# Altium schematic sheet Page10 BOOT_CFG.SchDoc
size 594 x 420 mm
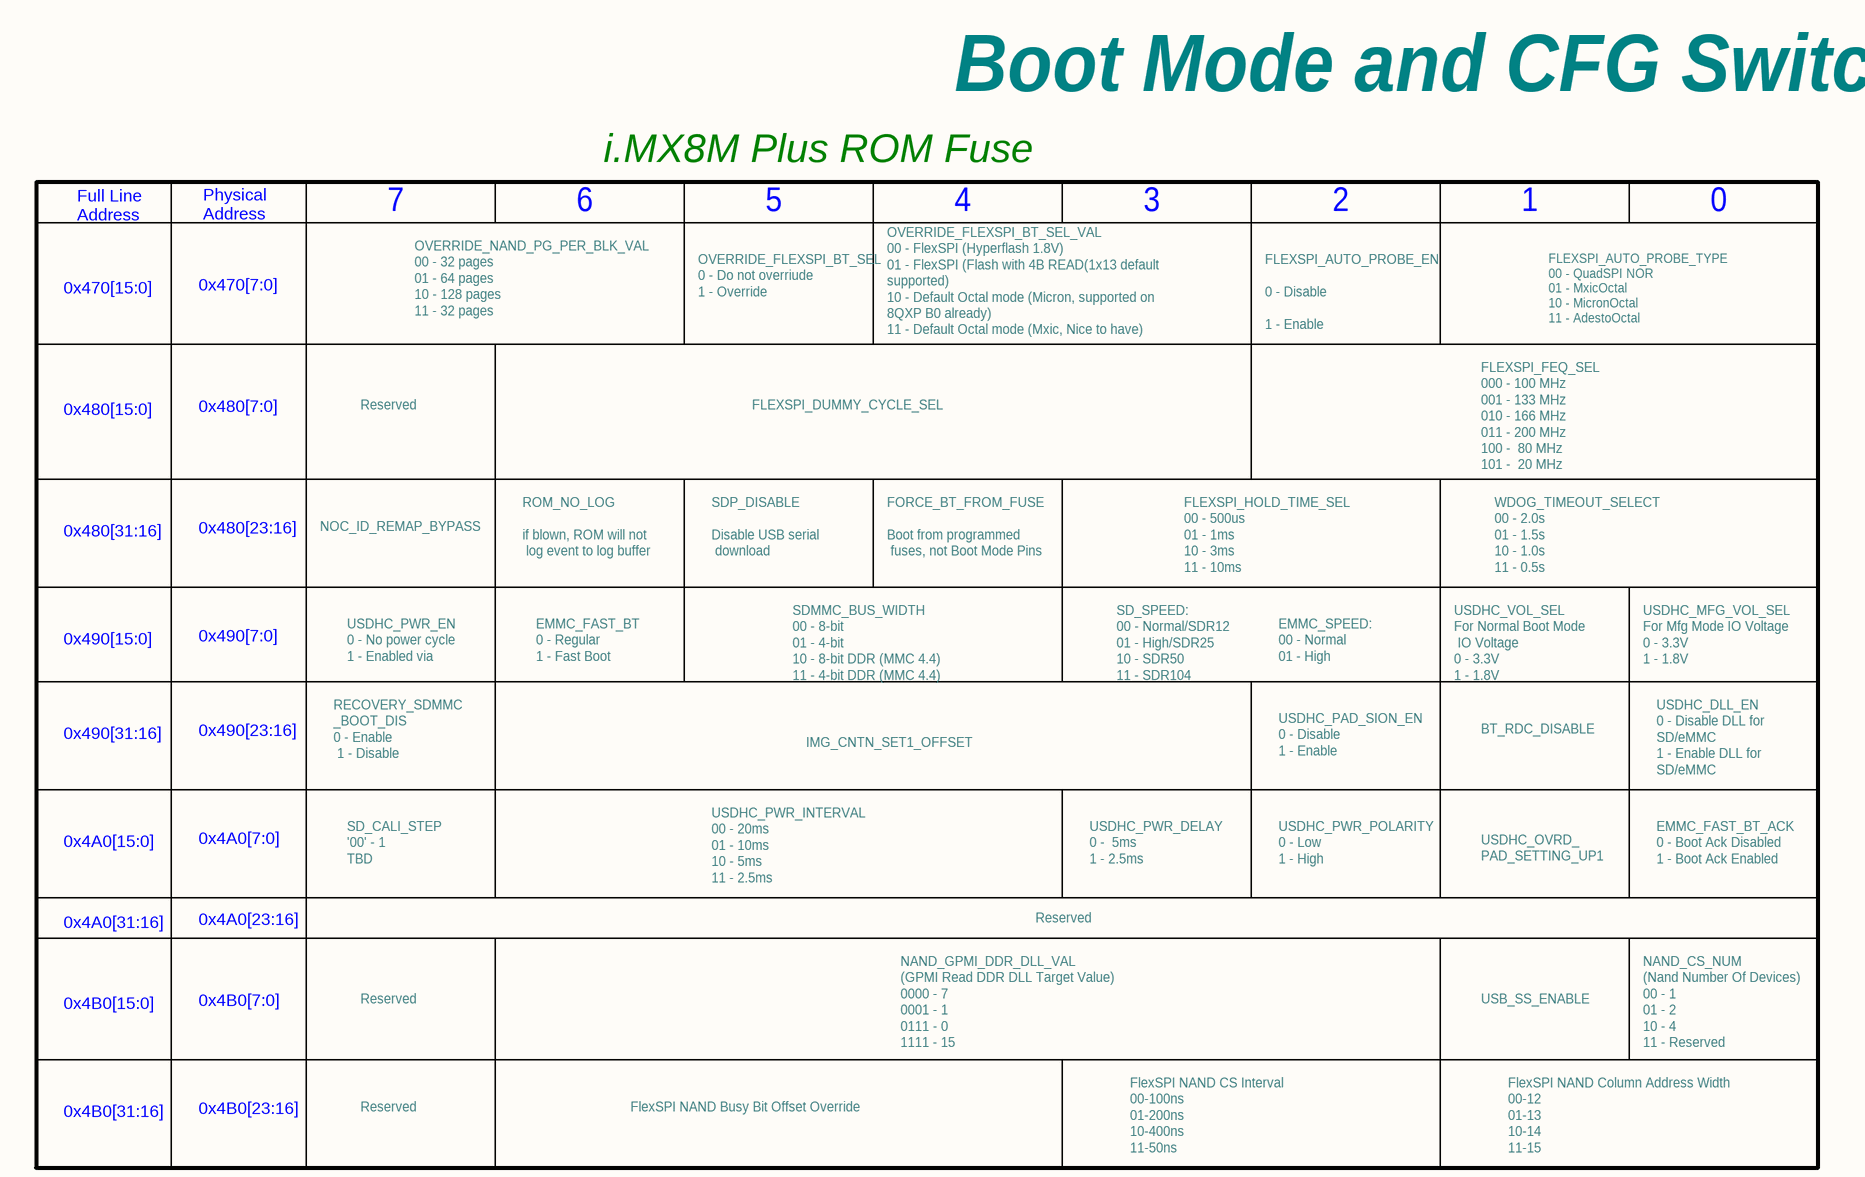
[diagram p0: Page10 BOOT_CFG.SchDoc, top left]
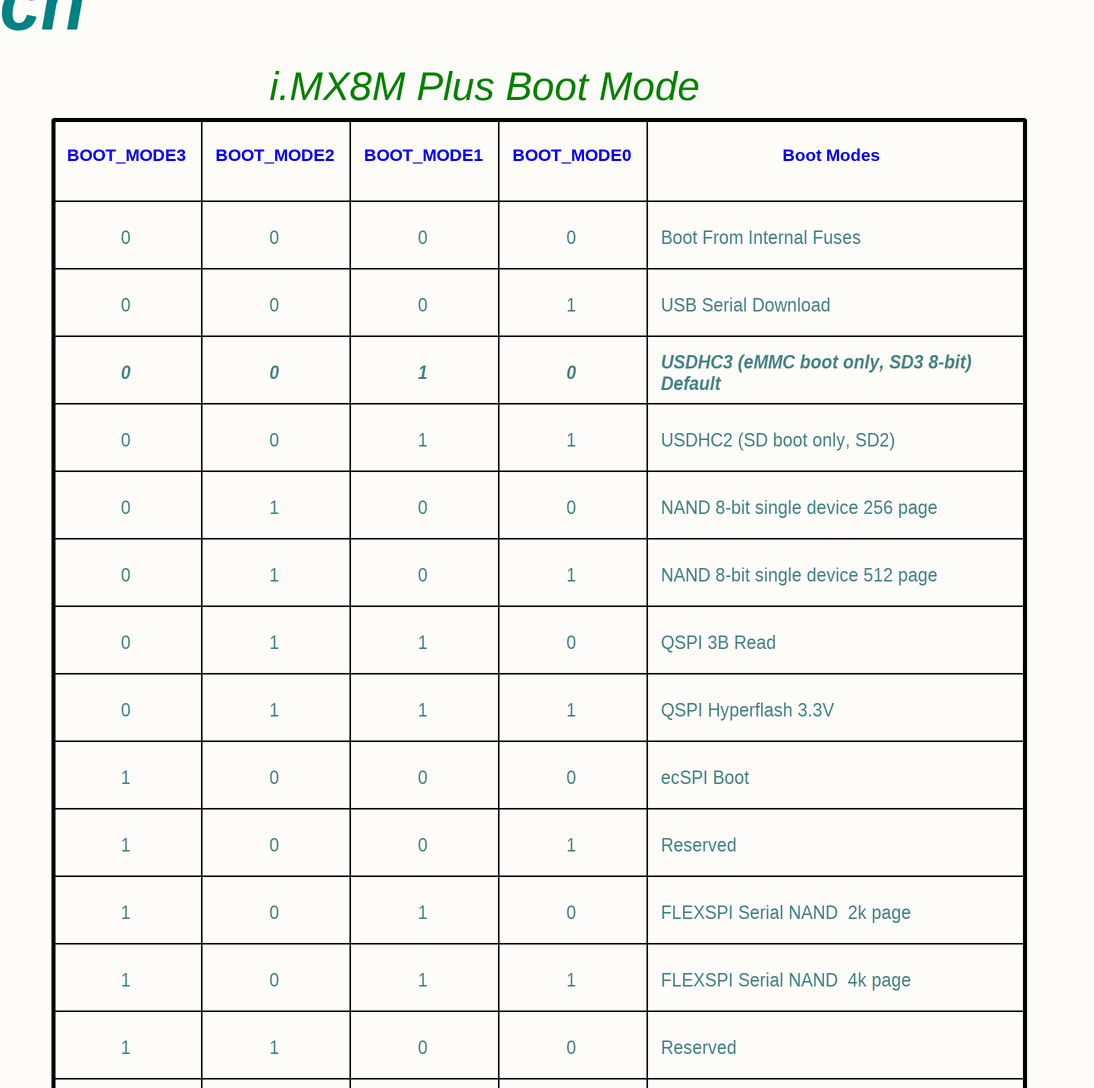
[diagram p1: Page10 BOOT_CFG.SchDoc, top right]
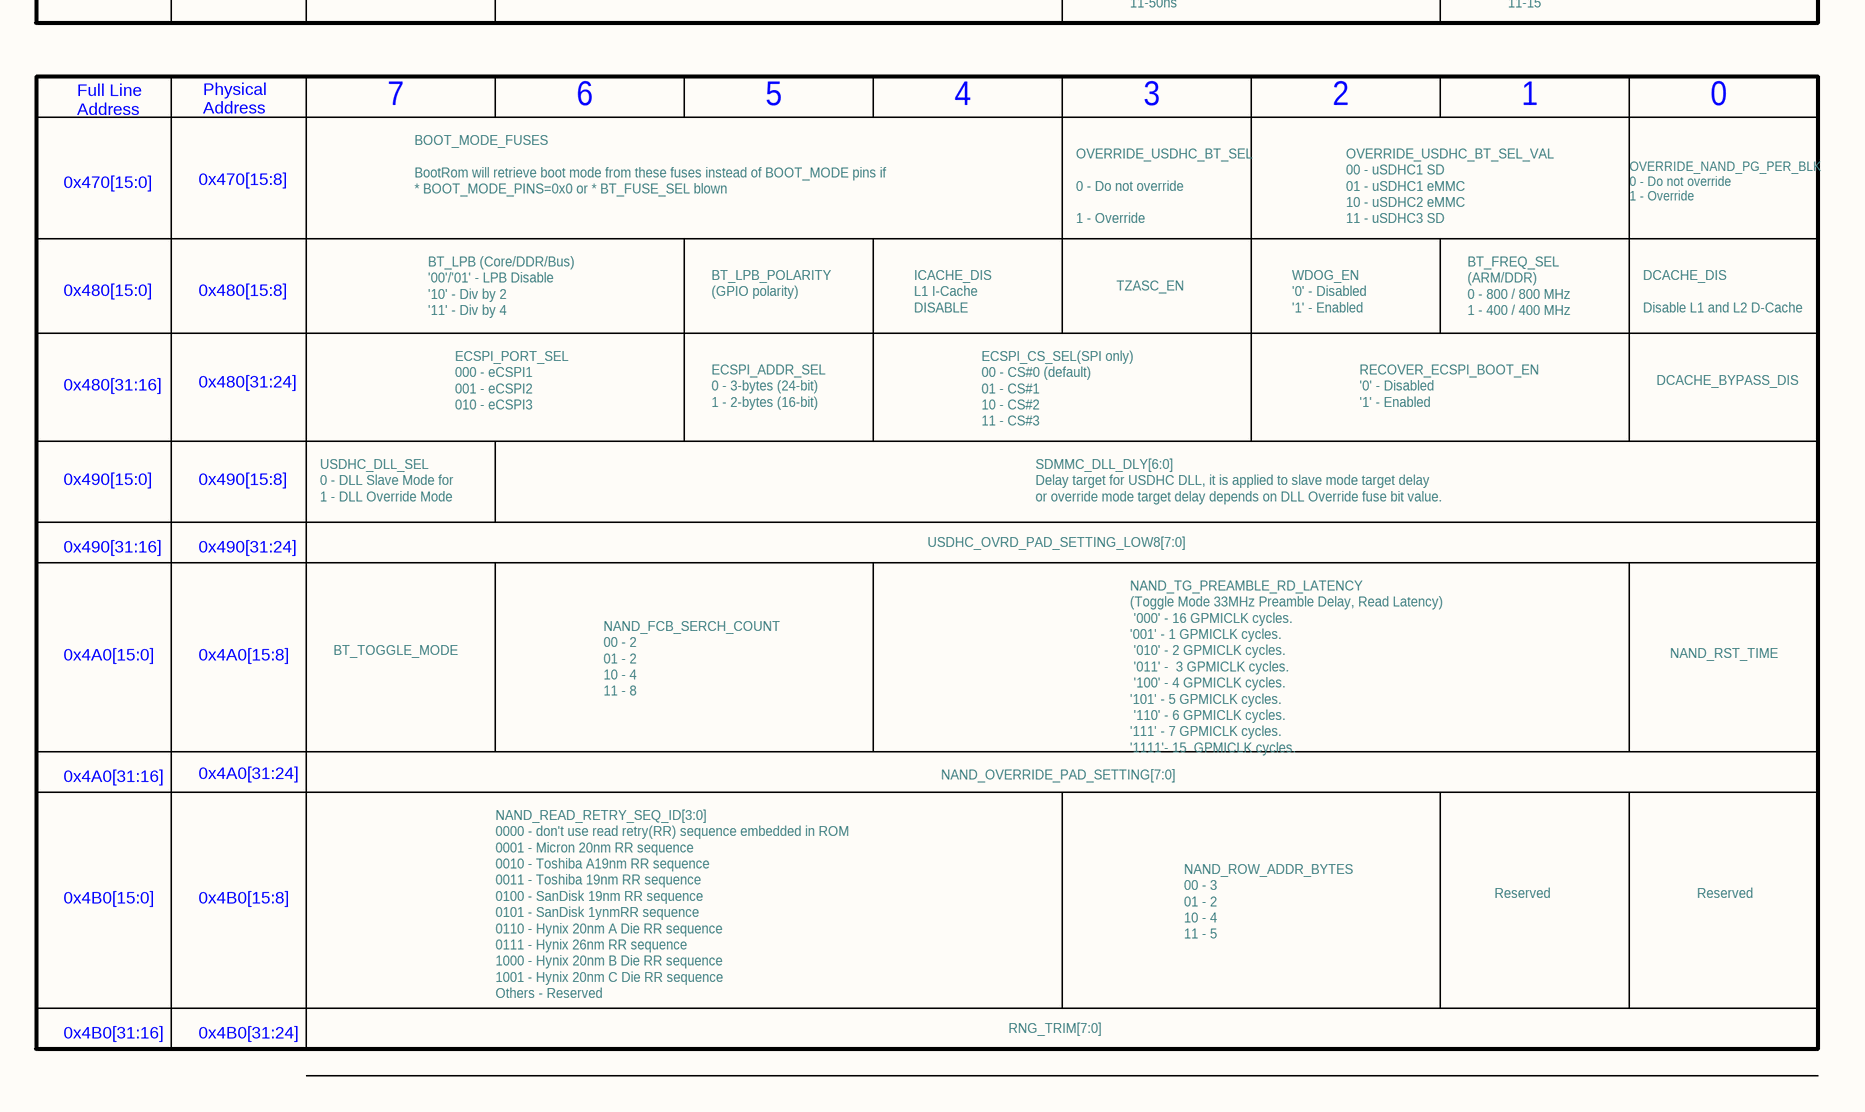
[diagram p2: Page10 BOOT_CFG.SchDoc, bottom left]
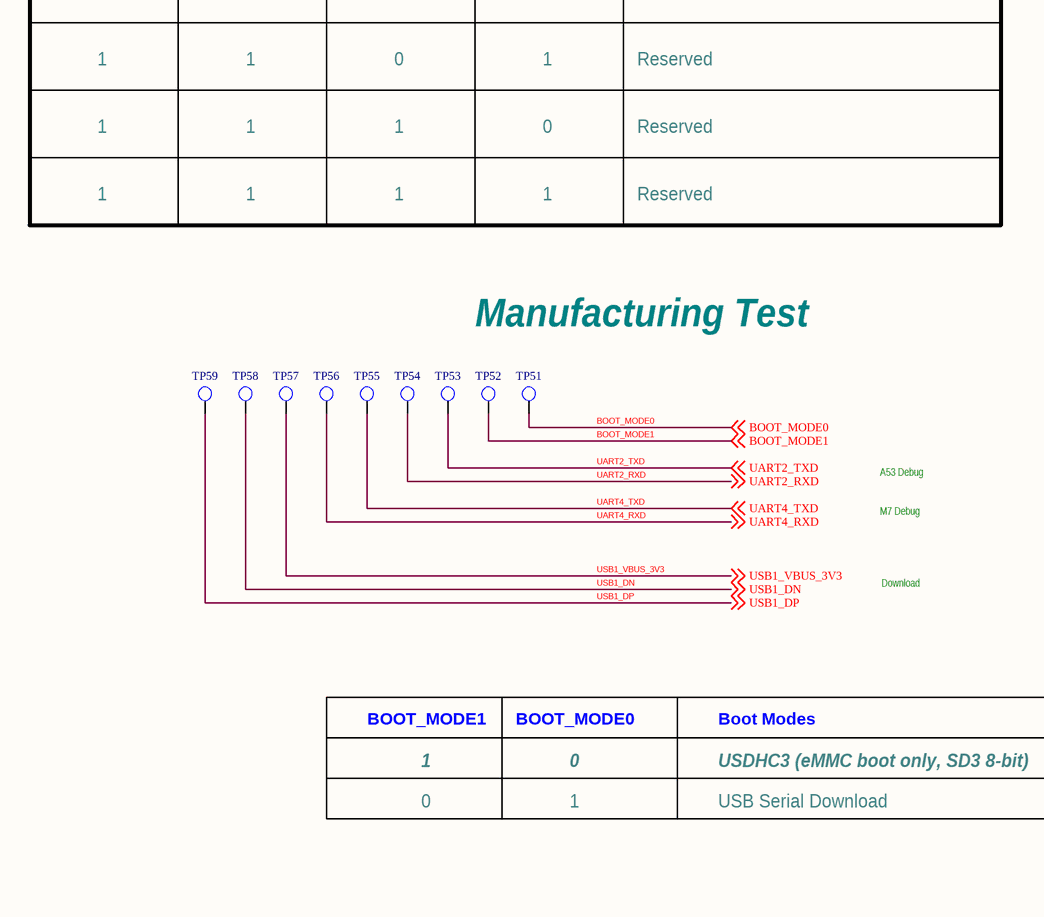
[diagram p3: Page10 BOOT_CFG.SchDoc, bottom right]

## Parts
TP51  TP_35MIL  [testpoint_35mil]  (value not drawn)
TP52  TP_35MIL  [testpoint_35mil]  (value not drawn)
TP53  TP_35MIL  [testpoint_35mil]  (value not drawn)
TP54  TP_35MIL  [testpoint_35mil]  (value not drawn)
TP55  TP_35MIL  [testpoint_35mil]  (value not drawn)
TP56  TP_35MIL  [testpoint_35mil]  (value not drawn)
TP57  TP_35MIL  [testpoint_35mil]  (value not drawn)
TP58  TP_35MIL  [testpoint_35mil]  (value not drawn)
TP59  TP_35MIL  [testpoint_35mil]  (value not drawn)

## Nets
BOOT_MODE0: TP51.1(TP) ; off-sheet BOOT_MODE0
BOOT_MODE1: TP52.1(TP) ; off-sheet BOOT_MODE1
UART2_RXD: TP54.1(TP) ; off-sheet UART2_RXD
UART2_TXD: TP53.1(TP) ; off-sheet UART2_TXD
UART4_RXD: TP56.1(TP) ; off-sheet UART4_RXD
UART4_TXD: TP55.1(TP) ; off-sheet UART4_TXD
USB1_DN: TP58.1(TP) ; off-sheet USB1_DN
USB1_DP: TP59.1(TP) ; off-sheet USB1_DP
USB1_VBUS_3V3: TP57.1(TP) ; off-sheet USB1_VBUS_3V3

## Notes on the sheet
- Boot Mode and CFG Switch
- Full Line
  Address
- Physical
  Address
- 7
- 6
- i.MX8M Plus ROM Fuse
- 5
- OVERRIDE_FLEXSPI_BT_SEL_VAL
  00 - FlexSPI (Hyperflash 1.8V)
  01 - FlexSPI (Flash with 4B READ(1x13 default
  supported)
  10 - Default Octal mode (Micron, supported on
  8QXP B0 already)
  11 - Default Octal mode (Mxic, Nice to have)
- 4
- 3
- 2
- 1
- 0
- BOOT_MODE3
- BOOT_MODE2
- i.MX8M Plus Boot Mode
- BOOT_MODE1
- BOOT_MODE0
- Boot Modes
- 0x470[15:0]
- 0x470[7:0]
- OVERRIDE_NAND_PG_PER_BLK_VAL
  00 - 32 pages
  01 - 64 pages
  10 - 128 pages
  11 - 32 pages
- OVERRIDE_FLEXSPI_BT_SEL
  0 - Do not overriude
  1 - Override
- FLEXSPI_AUTO_PROBE_EN
  0 - Disable
  1 - Enable
- FLEXSPI_AUTO_PROBE_TYPE
  00 - QuadSPI NOR
  01 - MxicOctal
  10 - MicronOctal
  11 - AdestoOctal
- FLEXSPI_FEQ_SEL
  000 - 100 MHz
  001 - 133 MHz
  010 - 166 MHz
  011 - 200 MHz
  100 -  80 MHz
  101 -  20 MHz
- Boot From Internal Fuses
- 0x480[15:0]
- 0x480[7:0]
- Reserved
- FLEXSPI_DUMMY_CYCLE_SEL
- USB Serial Download
- USDHC3 (eMMC boot only, SD3 8-bit)
  Default
- ROM_NO_LOG
  if blown, ROM will not
  log event to log buffer
- SDP_DISABLE
  Disable USB serial
  download
- FORCE_BT_FROM_FUSE
  Boot from programmed
  fuses, not Boot Mode Pins
- FLEXSPI_HOLD_TIME_SEL
  00 - 500us
  01 - 1ms
  10 - 3ms
  11 - 10ms
- WDOG_TIMEOUT_SELECT
  00 - 2.0s
  01 - 1.5s
  10 - 1.0s
  11 - 0.5s
- 0x480[31:16]
- 0x480[23:16]
- NOC_ID_REMAP_BYPASS
- USDHC2 (SD boot only, SD2)
- 0x490[15:0]
- USDHC_PWR_EN
  0 - No power cycle
  1 - Enabled via
- EMMC_FAST_BT
  0 - Regular
  1 - Fast Boot
- SDMMC_BUS_WIDTH
  00 - 8-bit
  01 - 4-bit
  10 - 8-bit DDR (MMC 4.4)
  11 - 4-bit DDR (MMC 4.4)
- SD_SPEED:
  00 - Normal/SDR12
  01 - High/SDR25
  10 - SDR50
  11 - SDR104
- EMMC_SPEED:
  00 - Normal
  01 - High
- USDHC_VOL_SEL
  For Normal Boot Mode
  IO Voltage
  0 - 3.3V
  1 - 1.8V
- USDHC_MFG_VOL_SEL
  For Mfg Mode IO Voltage
  0 - 3.3V
  1 - 1.8V
- NAND 8-bit single device 256 page
- 0x490[7:0]
- RECOVERY_SDMMC
  _BOOT_DIS
  0 - Enable
  1 - Disable
- USDHC_DLL_EN
  0 - Disable DLL for
  SD/eMMC
  1 - Enable DLL for
  SD/eMMC
- NAND 8-bit single device 512 page
- 0x490[31:16]
- 0x490[23:16]
- IMG_CNTN_SET1_OFFSET
- USDHC_PAD_SION_EN
  0 - Disable
  1 - Enable
- BT_RDC_DISABLE
- QSPI 3B Read
- 0x4A0[15:0]
- SD_CALI_STEP
  '00' - 1
  TBD
- USDHC_PWR_INTERVAL
  00 - 20ms
  01 - 10ms
  10 - 5ms
  11 - 2.5ms
- USDHC_PWR_DELAY
  0 -  5ms
  1 - 2.5ms
- USDHC_PWR_POLARITY
  0 - Low
  1 - High
- USDHC_OVRD_
  PAD_SETTING_UP1
- EMMC_FAST_BT_ACK
  0 - Boot Ack Disabled
  1 - Boot Ack Enabled
- QSPI Hyperflash 3.3V
- 0x4A0[7:0]
- ecSPI Boot
- 0x4A0[31:16]
- 0x4A0[23:16]
- NAND_GPMI_DDR_DLL_VAL
  (GPMI Read DDR DLL Target Value)
  0000 - 7
  0001 - 1
  0111 - 0
  1111 - 15
- NAND_CS_NUM
  (Nand Number Of Devices)
  00 - 1
  01 - 2
  10 - 4
  11 - Reserved
- 0x4B0[15:0]
- 0x4B0[7:0]
- USB_SS_ENABLE
- FLEXSPI Serial NAND  2k page
- 0x4B0[31:16]
- FlexSPI NAND CS Interval
  00-100ns
  01-200ns
  10-400ns
  11-50ns
- FlexSPI NAND Column Address Width
  00-12
  01-13
  10-14
  11-15
- FLEXSPI Serial NAND  4k page
- 0x4B0[23:16]
- FlexSPI NAND Busy Bit Offset Override
- BOOT_MODE_FUSES
  BootRom will retrieve boot mode from these fuses instead of BOOT_MODE pins if
  * BOOT_MODE_PINS=0x0 or * BT_FUSE_SEL blown
- OVERRIDE_USDHC_BT_SEL
  0 - Do not override
  1 - Override
- OVERRIDE_USDHC_BT_SEL_VAL
  00 - uSDHC1 SD
  01 - uSDHC1 eMMC
  10 - uSDHC2 eMMC
  11 - uSDHC3 SD
- OVERRIDE_NAND_PG_PER_BLK
  0 - Do not override
  1 - Override
- 0x470[15:8]
- 0x480[15:8]
- BT_LPB (Core/DDR/Bus)
  '00'/'01' - LPB Disable
  '10' - Div by 2
  '11' - Div by 4
- BT_LPB_POLARITY
  (GPIO polarity)
- ICACHE_DIS
  L1 I-Cache
  DISABLE
- TZASC_EN
- WDOG_EN
  '0' - Disabled
  '1' - Enabled
- BT_FREQ_SEL
  (ARM/DDR)
  0 - 800 / 800 MHz
  1 - 400 / 400 MHz
- DCACHE_DIS
  Disable L1 and L2 D-Cache
- ECSPI_PORT_SEL
  000 - eCSPI1
  001 - eCSPI2
  010 - eCSPI3
- ECSPI_ADDR_SEL
  0 - 3-bytes (24-bit)
  1 - 2-bytes (16-bit)
- ECSPI_CS_SEL(SPI only)
  00 - CS#0 (default)
  01 - CS#1
  10 - CS#2
  11 - CS#3
- RECOVER_ECSPI_BOOT_EN
  '0' - Disabled
  '1' - Enabled
- Manufacturing Test
- 0x480[31:24]
- DCACHE_BYPASS_DIS
- 0x490[15:8]
- USDHC_DLL_SEL
  0 - DLL Slave Mode for
  1 - DLL Override Mode
- SDMMC_DLL_DLY[6:0]
  Delay target for USDHC DLL, it is applied to slave mode target delay
  or override mode target delay depends on DLL Override fuse bit value.
- M7 Debug
- A53 Debug
- 0x490[31:24]
- USDHC_OVRD_PAD_SETTING_LOW8[7:0]
- Download
- NAND_FCB_SERCH_COUNT
  00 - 2
  01 - 2
  10 - 4
  11 - 8
- NAND_TG_PREAMBLE_RD_LATENCY
  (Toggle Mode 33MHz Preamble Delay, Read Latency)
  '000' - 16 GPMICLK cycles.
  '001' - 1 GPMICLK cycles.
  '010' - 2 GPMICLK cycles.
  '011' -  3 GPMICLK cycles.
  '100' - 4 GPMICLK cycles.
  '101' - 5 GPMICLK cycles.
  '110' - 6 GPMICLK cycles.
  '111' - 7 GPMICLK cycles.
  '1111'- 15  GPMICLK cycles.
- 0x4A0[15:8]
- BT_TOGGLE_MODE
- NAND_RST_TIME
- NAND_OVERRIDE_PAD_SETTING[7:0]
- USDHC3 (eMMC boot only, SD3 8-bit)
- 0x4A0[31:24]
- NAND_READ_RETRY_SEQ_ID[3:0]
  0000 - don't use read retry(RR) sequence embedded in ROM
  0001 - Micron 20nm RR sequence
  0010 - Toshiba A19nm RR sequence
  0011 - Toshiba 19nm RR sequence
  0100 - SanDisk 19nm RR sequence
  0101 - SanDisk 1ynmRR sequence
  0110 - Hynix 20nm A Die RR sequence
  0111 - Hynix 26nm RR sequence
  1000 - Hynix 20nm B Die RR sequence
  1001 - Hynix 20nm C Die RR sequence
  Others - Reserved
- 0x4B0[15:8]
- NAND_ROW_ADDR_BYTES
  00 - 3
  01 - 2
  10 - 4
  11 - 5
- 0x4B0[31:24]
- RNG_TRIM[7:0]

## Library data of the parts
TP51 TP54 TP56 TP58 = T POINT R: TEST POINT PAD .035 SMT, no part to order; CLASS: IC; ASSY_OPT: DNP; AGILE_PN: 510-75618; CAD_APPROVED: Yes; PCB Footprint: testpoint_35mil; ROHS: Yes; HEIGHT: 0.1MM
TP52 TP53 TP55 TP57 TP59 = T POINT R: TEST POINT PAD .035 SMT, no part to order; CLASS: IC; ASSY_OPT: DNP; CAD_APPROVED: Yes; AGILE_PN: 510-75618; PCB Footprint: testpoint_35mil; HEIGHT: 0.1MM; ROHS: Yes